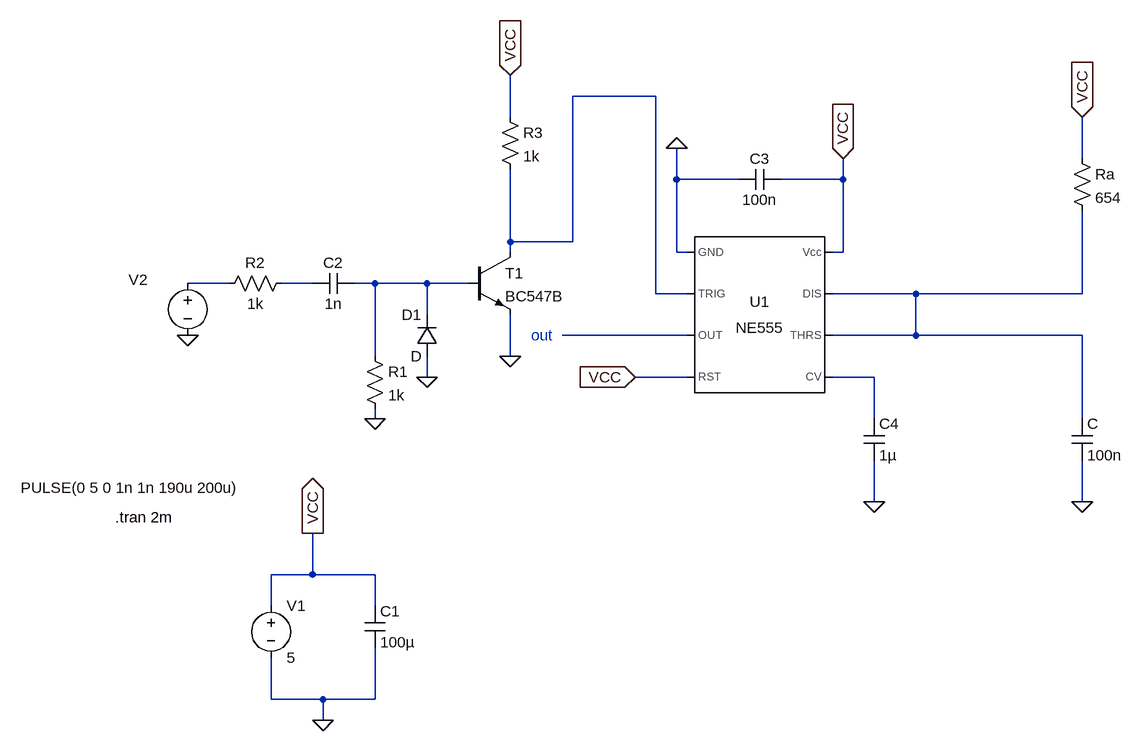
[diagram p0: schematic lab6Scheme.asc]
lab6Scheme.asc, the LTspice schematic file:
Version 4
SHEET 1 880 804
WIRE -32 -176 -160 -176
WIRE -256 -144 -256 -208
WIRE 624 -80 624 -144
WIRE 0 -48 0 -96
WIRE 96 -48 0 -48
WIRE 256 -48 256 -80
WIRE 256 -48 160 -48
WIRE -256 48 -256 -64
WIRE -160 48 -160 -176
WIRE -160 48 -256 48
WIRE -256 64 -256 48
WIRE 0 64 0 -48
WIRE 16 64 0 64
WIRE 256 64 256 -48
WIRE 256 64 240 64
WIRE -688 112 -752 112
WIRE -560 112 -608 112
WIRE -464 112 -496 112
WIRE -384 112 -464 112
WIRE -320 112 -384 112
WIRE -32 128 -32 -176
WIRE 16 128 -32 128
WIRE 368 128 240 128
WIRE 624 128 624 0
WIRE 624 128 368 128
WIRE -384 160 -384 112
WIRE 16 192 -176 192
WIRE 368 192 368 128
WIRE 368 192 240 192
WIRE 624 192 368 192
WIRE -464 224 -464 112
WIRE -256 224 -256 160
WIRE -384 256 -384 224
WIRE 16 256 -64 256
WIRE 304 256 240 256
WIRE -464 320 -464 304
WIRE 304 320 304 256
WIRE 624 320 624 192
WIRE 304 448 304 384
WIRE 624 448 624 384
WIRE -560 560 -560 496
WIRE -560 560 -624 560
WIRE -464 560 -560 560
WIRE -624 608 -624 560
WIRE -464 608 -464 560
WIRE -624 752 -624 688
WIRE -544 752 -624 752
WIRE -464 752 -464 672
WIRE -464 752 -544 752
WIRE -544 784 -544 752
FLAG -560 496 VCC
IOPIN -560 496 Out
FLAG -544 784 0
FLAG -384 256 0
FLAG -256 224 0
FLAG -256 -208 VCC
IOPIN -256 -208 In
FLAG 0 -96 0
FLAG 256 -80 VCC
IOPIN 256 -80 In
FLAG -64 256 VCC
IOPIN -64 256 In
FLAG 624 -144 VCC
IOPIN 624 -144 In
FLAG 624 448 0
FLAG -752 192 0
FLAG 304 448 0
FLAG -464 320 0
SYMBOL Misc\\NE555 128 160 R0
SYMATTR InstName U1
SYMBOL npn -320 64 R0
SYMATTR InstName T1
SYMATTR Value BC547B
SYMBOL voltage -624 592 R0
SYMATTR InstName V1
SYMATTR Value 5
SYMBOL cap -480 608 R0
SYMATTR InstName C1
SYMATTR Value 100µ
SYMBOL voltage -752 96 R0
WINDOW 0 -91 10 Left 2
WINDOW 3 -257 330 Left 2
WINDOW 123 0 0 Left 0
WINDOW 39 0 0 Left 0
SYMATTR InstName V2
SYMATTR Value PULSE(0 5 0 1n 1n 190u 200u)
SYMBOL res -480 208 R0
SYMATTR InstName R1
SYMATTR Value 1k
SYMBOL res -592 96 R90
WINDOW 0 0 56 VBottom 2
WINDOW 3 32 56 VTop 2
SYMATTR InstName R2
SYMATTR Value 1k
SYMBOL cap -496 96 R90
WINDOW 0 0 32 VBottom 2
WINDOW 3 32 32 VTop 2
SYMATTR InstName C2
SYMATTR Value 1n
SYMBOL diode -368 224 R180
WINDOW 0 24 64 Left 2
WINDOW 3 24 0 Left 2
SYMATTR InstName D1
SYMBOL res -272 -160 R0
SYMATTR InstName R3
SYMATTR Value 1k
SYMBOL cap 160 -64 R90
WINDOW 0 0 32 VBottom 2
WINDOW 3 32 32 VTop 2
SYMATTR InstName C3
SYMATTR Value 100n
SYMBOL cap 608 320 R0
SYMATTR InstName C
SYMATTR Value 100n
SYMBOL res 608 -96 R0
SYMATTR InstName Ra
SYMATTR Value 654
SYMBOL cap 288 320 R0
SYMATTR InstName C4
SYMATTR Value 1µ
TEXT -864 472 Left 2 !.tran 2m
TEXT -224 192 Left 2 ;out

The netlist it stands for:
* lab6Scheme.asc
XU1 0 N001 N006 VCC N007 N005 N005 VCC NE555  ; pins GND TRIG OUT RST CV THRS DIS Vcc
Q§T1 N001 N004 0 0 BC547B
V1 VCC 0 5
C1 VCC 0 100µ
V2 N002 0 PULSE(0 5 0 1n 1n 190u 200u)
R1 N004 0 1k
R2 N003 N002 1k
C2 N004 N003 1n
D1 0 N004 D
R3 VCC N001 1k
C3 VCC 0 100n
C N005 0 100n
Ra VCC N005 654
C4 N007 0 1µ
.model D D
.lib standard.dio
.model NPN NPN
.model PNP PNP
.lib standard.bjt
.tran 2m
* out
.lib NE555.sub
.backanno
.end